# Altium schematic sheet main.SchDoc
size A2; SheetNumber: 1; SheetTotal: 4
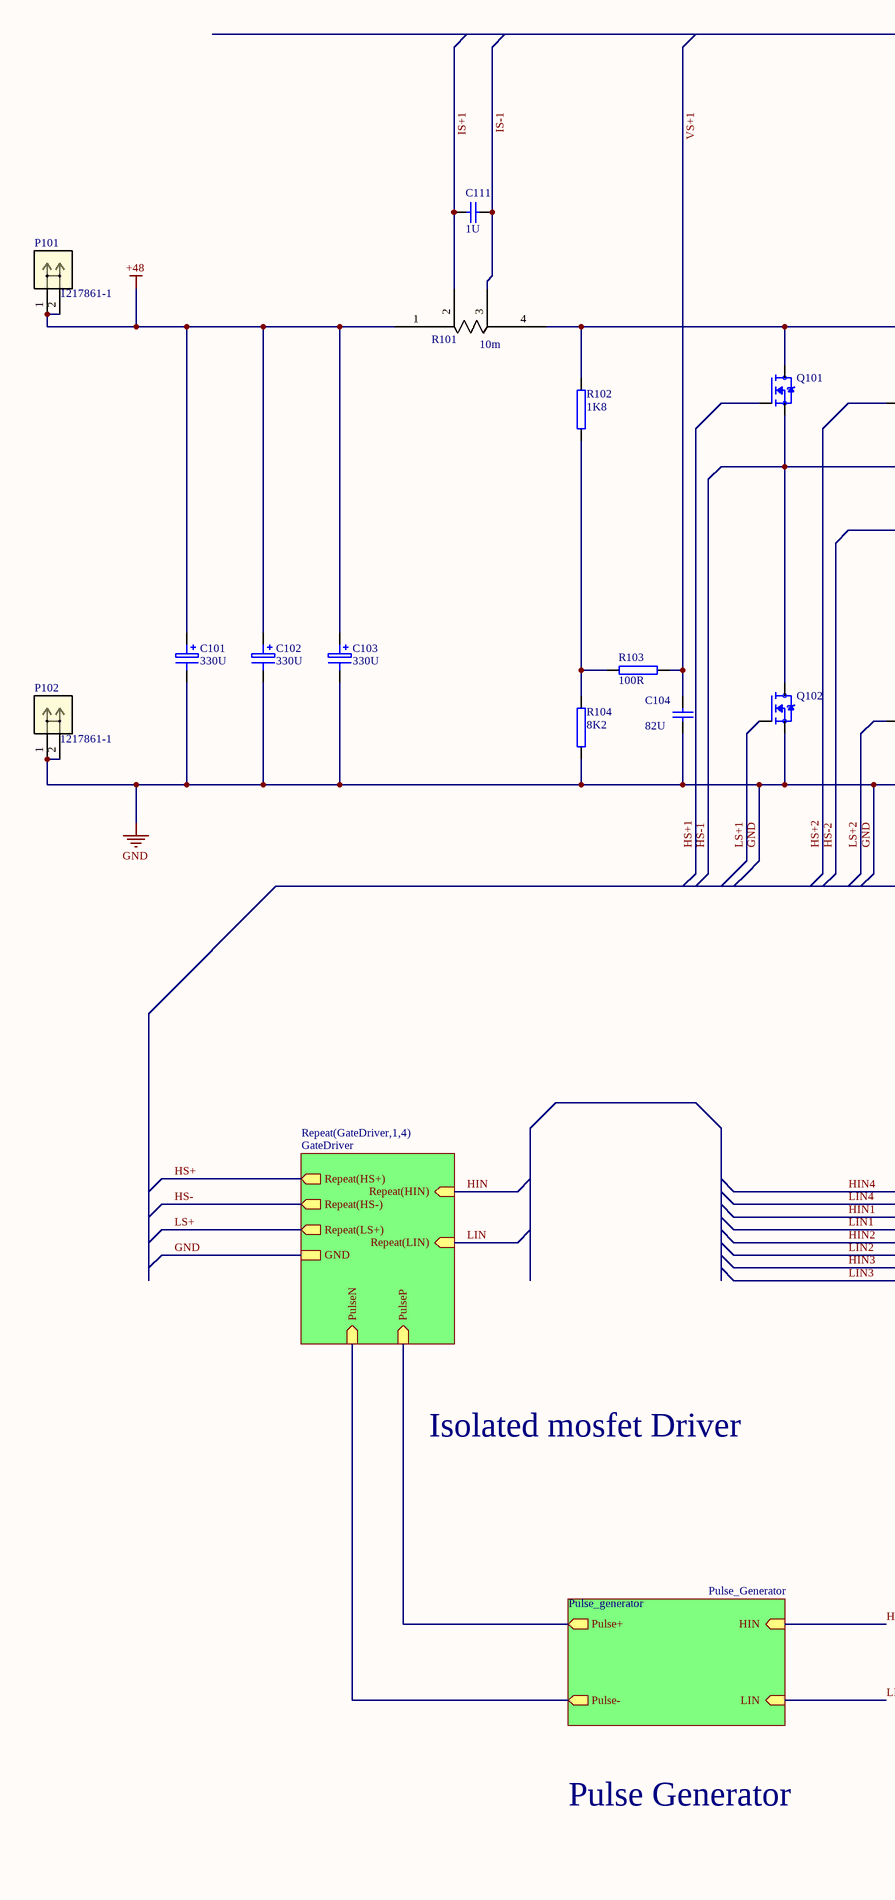
[diagram p0: main.SchDoc, left]
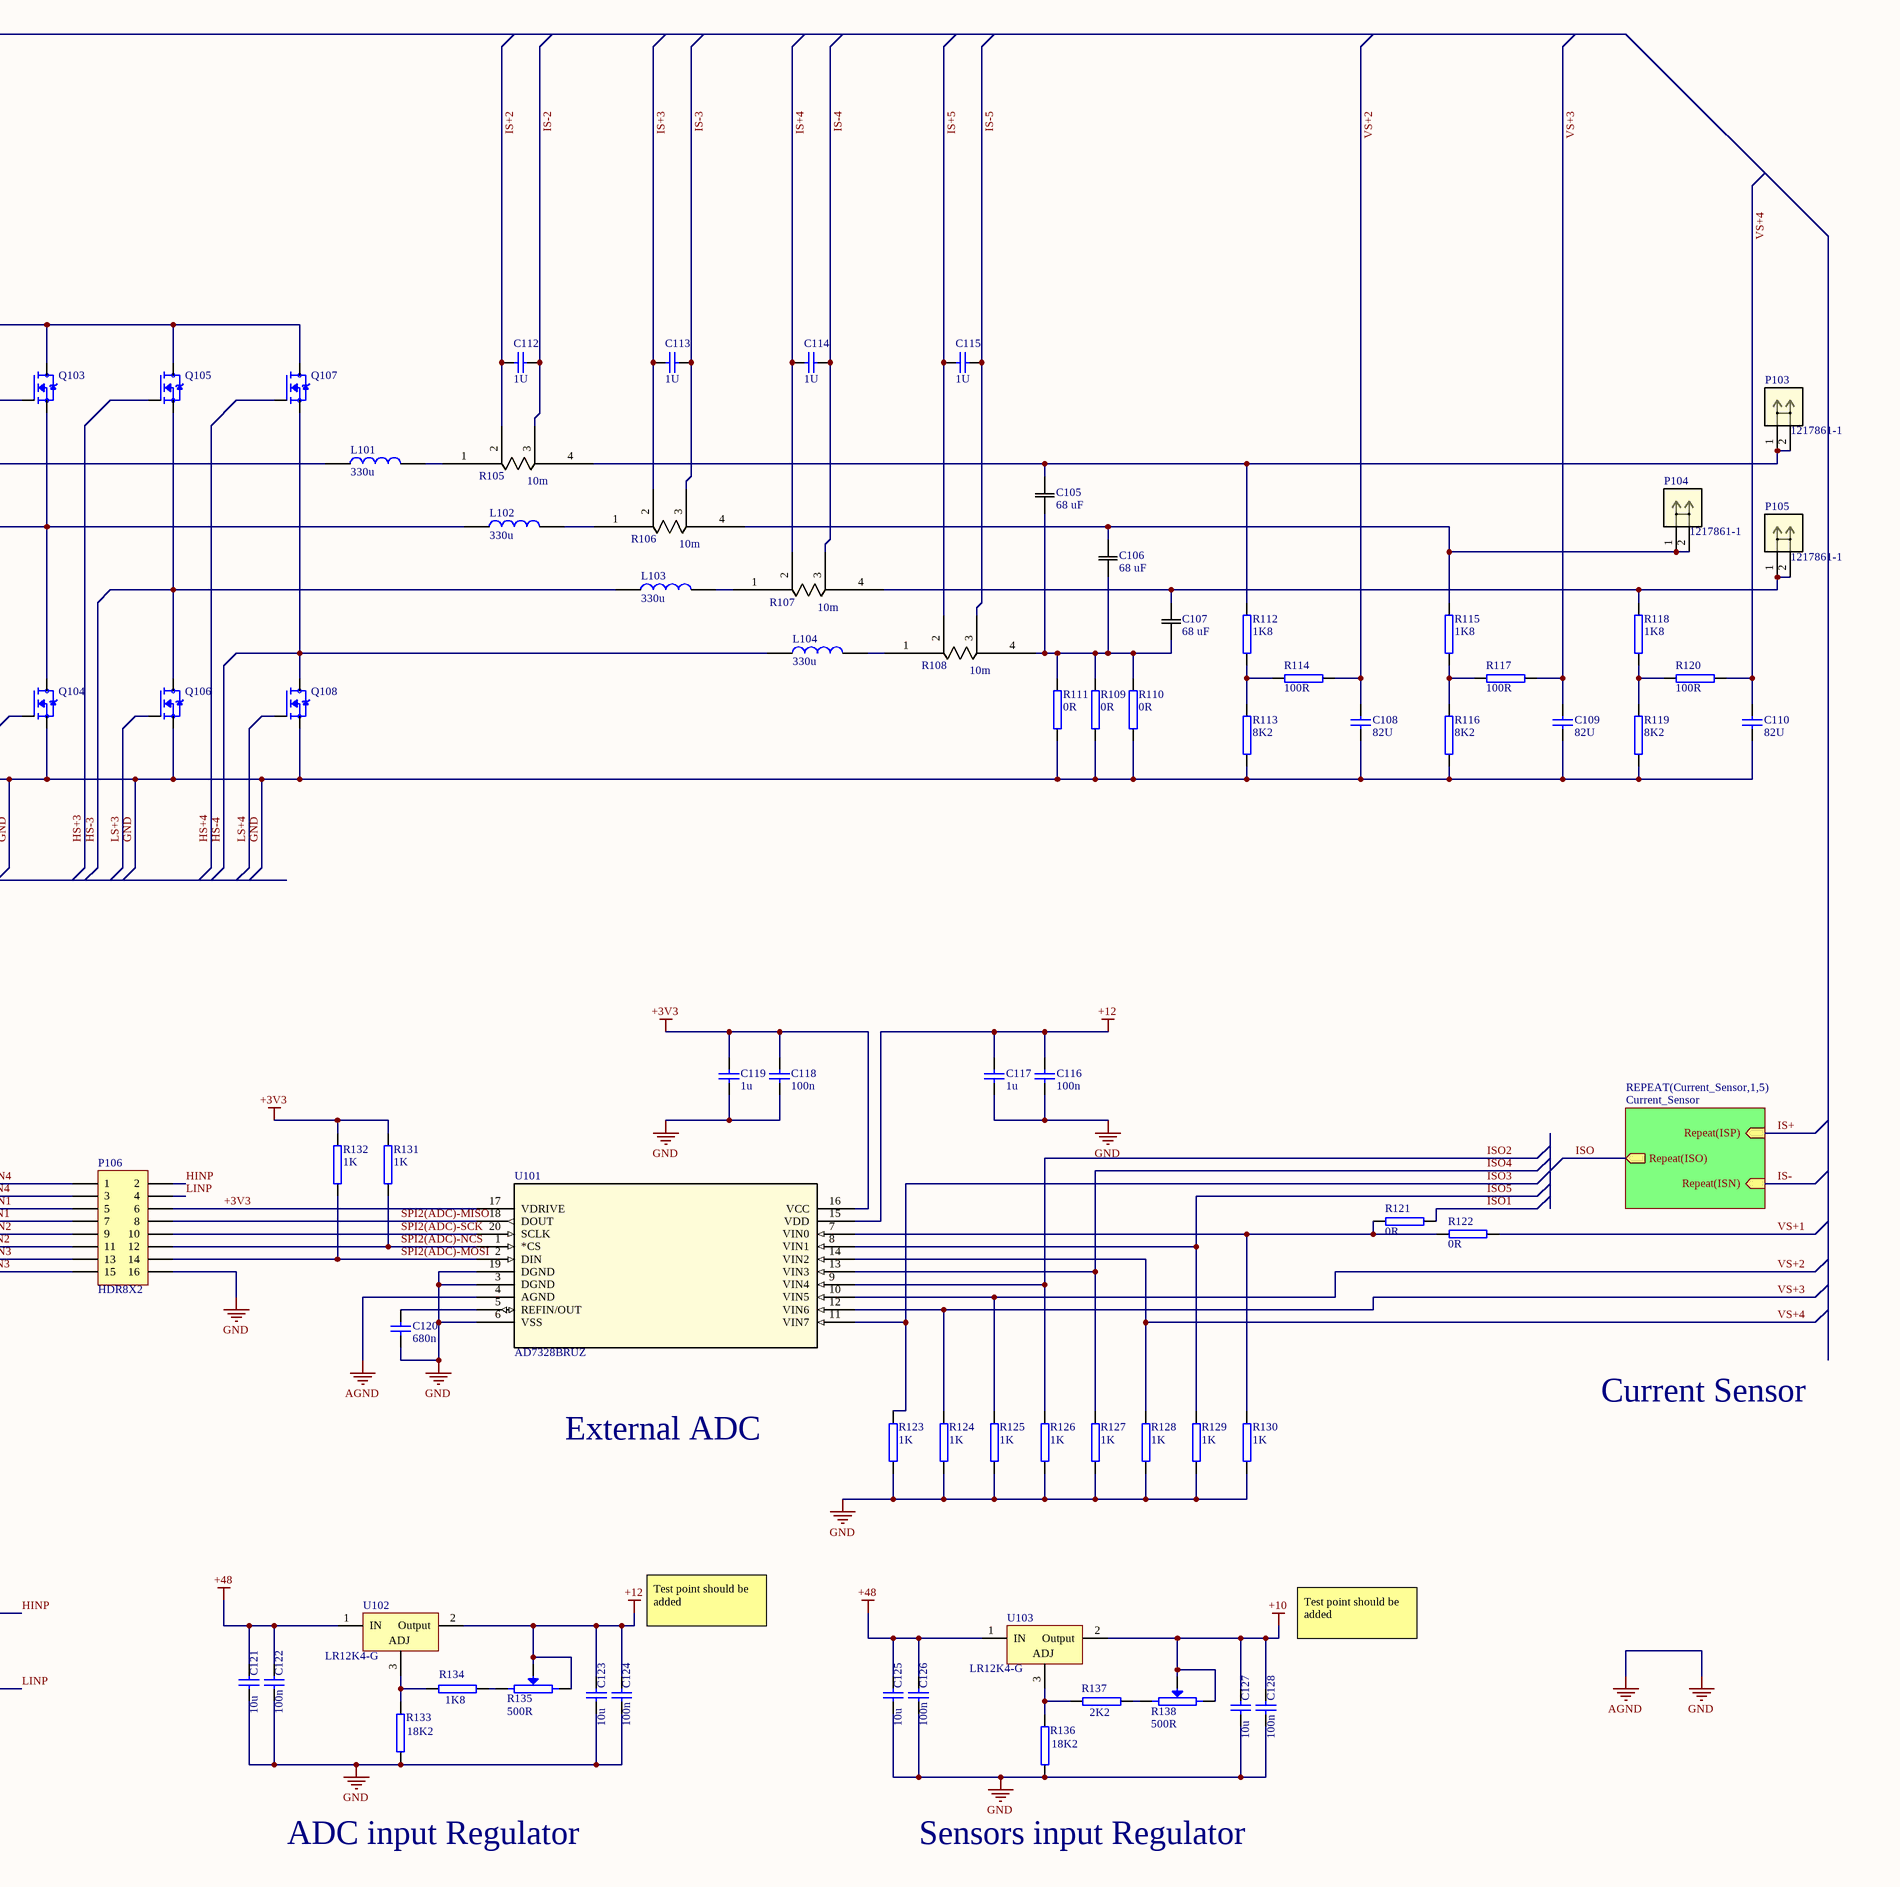
[diagram p1: main.SchDoc, right]

## Parts
C101  330U  [CAPP300-600_AUT]
C102  330U  [CAPP300-600_AUT]
C103  330U  [CAPP300-600_AUT]
C104  82U  [CAP_1206]
C105  68 uF  [B32526R3686K000]
C106  68 uF  [B32526R3686K000]
C107  68 uF  [B32526R3686K000]
C108  82U  [CAP_1206]
C109  82U  [CAP_1206]
C110  82U  [CAP_1206]
C111  1U  [CAP_1206]
C112  1U  [CAP_1206]
C113  1U  [CAP_1206]
C114  1U  [CAP_1206]
C115  1U  [CAP_1206]
C116  100n  [CAP_1206]
C117  1u  [CAP_1206]
C118  100n  [CAP_1206]
C119  1u  [CAP_1206]
C120  680n  [CAP_1206]
C121  10u  [CAP_1206]
C122  100n  [CAP_1206]
C123  10u  [CAP_1206]
C124  100n  [CAP_1206]
C125  10u  [CAP_1206]
C126  100n  [CAP_1206]
C127  10u  [CAP_1206]
C128  100n  [CAP_1206]
L101  330u  [1140-331K-RC]
L102  330u  [1140-331K-RC]
L103  330u  [1140-331K-RC]
L104  330u  [1140-331K-RC]
P101  1217861-1  [CONN_1217861-1_TEC]
P102  1217861-1  [CONN_1217861-1_TEC]
P103  1217861-1  [CONN_1217861-1_TEC]
P104  1217861-1  [CONN_1217861-1_TEC]
P105  1217861-1  [CONN_1217861-1_TEC]
P106  HDR8X2  [HDR2X8_AUT]
Q101  MCTL80N20Y-TP  [TOLL-8L]  (value not drawn)
Q102  MCTL80N20Y-TP  [TOLL-8L]  (value not drawn)
Q103  MCTL80N20Y-TP  [TOLL-8L]  (value not drawn)
Q104  MCTL80N20Y-TP  [TOLL-8L]  (value not drawn)
Q105  MCTL80N20Y-TP  [TOLL-8L]  (value not drawn)
Q106  MCTL80N20Y-TP  [TOLL-8L]  (value not drawn)
Q107  MCTL80N20Y-TP  [TOLL-8L]  (value not drawn)
Q108  MCTL80N20Y-TP  [TOLL-8L]  (value not drawn)
R101  10m  [WSL3673R_002-01]
R102  1K8  [RES_1206]
R103  100R  [RES_1206]
R104  8K2  [RES_1206]
R105  10m  [WSL3673R_002-01]
R106  10m  [WSL3673R_002-01]
R107  10m  [WSL3673R_002-01]
R108  10m  [WSL3673R_002-01]
R109  0R  [RES_1206]
R110  0R  [RES_1206]
R111  0R  [RES_1206]
R112  1K8  [RES_1206]
R113  8K2  [RES_1206]
R114  100R  [RES_1206]
R115  1K8  [RES_1206]
R116  8K2  [RES_1206]
R117  100R  [RES_1206]
R118  1K8  [RES_1206]
R119  8K2  [RES_1206]
R120  100R  [RES_1206]
R121  0R  [RES_1206]
R122  0R  [RES_1206]
R123  1K  [RES_1206]
R124  1K  [RES_1206]
R125  1K  [RES_1206]
R126  1K  [RES_1206]
R127  1K  [RES_1206]
R128  1K  [RES_1206]
R129  1K  [RES_1206]
R130  1K  [RES_1206]
R131  1K  [RES_1206]
R132  1K  [RES_1206]
R133  18K2  [RES_1206]
R134  1K8  [RES_1206]
R135  500R  [3296W]
R136  18K2  [RES_1206]
R137  2K2  [RES_1206]
R138  500R  [3296W]
U101  AD7328BRUZ  [TSSOP20_44]
U102  LR12K4-G  [D PAK (TO-252-3)]
U103  LR12K4-G  [D PAK (TO-252-3)]

## Sub-sheets
Pulse_generator = Pulse_Generator: HIN (in), LIN (in), Pulse+ (out), Pulse- (out)
REPEAT(Current_Sensor,1,5) = Current_Sensor: Repeat(ISP) (in), Repeat(ISN) (in), Repeat(ISO) (out)
Repeat(GateDriver,1,4) = GateDriver: Repeat(HIN) (in), Repeat(LIN) (in), Repeat(HS+) (out), Repeat(HS-) (out), Repeat(LS+) (out), GND, PulseN (in), PulseP (in)

## Nets
+3V3: C118.2 C119.2 P106.6 R131.2 R132.2 U101.16(VCC) U101.17(VDRIVE)
+10: C127.2 C128.2 R138.2(BOT) R138.W(TAP) U103.2(Output)
+12: C116.2 C117.2 C123.2 C124.2 R135.2(BOT) R135.W(TAP) U101.15(VDD) U102.2(Output)
+48: C101.1 C102.1 C103.1 C121.2 C122.2 C125.2 C126.2 P101.1 P101.2 R101.1 U102.1(IN) U103.1(IN)
GND: C101.2 C102.2 C103.2 C104.1 C108.1 C109.1 C110.1 C116.1 C117.1 C118.1 C119.1 C120.1 C121.1 C122.1 C123.1 C124.1 C125.1 C126.1 C127.1 C128.1 P102.1 P102.2 P106.16 Q102.2(S) Q104.2(S) Q106.2(S) Q108.2(S) R104.1 R109.2 R110.1 R111.2 R113.1 R116.1 R119.1 R123.1 R124.1 R125.1 R126.1 R127.1 R128.1 R129.1 R130.1 R133.1 R136.1 U101.3(DGND) U101.4(AGND) U101.6(VSS) U101.19(DGND) ; sheet Repeat(GateDriver,1,4)/GND  [also labelled AGND]
HIN: sheet Repeat(GateDriver,1,4)/Repeat(HIN)
HIN1: P106.5
HIN2: P106.9
HIN3: P106.13
HIN4: P106.1
HINP: P106.2 ; sheet Pulse_generator/HIN
HS+: sheet Repeat(GateDriver,1,4)/Repeat(HS+)
HS+1: Q101.1(G)
HS+2: Q103.1(G)
HS+3: Q105.1(G)
HS+4: Q107.1(G)
HS-: sheet Repeat(GateDriver,1,4)/Repeat(HS-)
HS-1: L101.1 Q101.2(S) Q102.3(D)
HS-2: L102.1 Q103.2(S) Q104.3(D)
HS-3: L103.1 Q105.2(S) Q106.3(D)
HS-4: L104.1 Q107.2(S) Q108.3(D)
IS+: sheet REPEAT(Current_Sensor,1,5)/Repeat(ISP)
IS+1: C111.2 R101.2
IS+2: C112.2 R105.2
IS+3: C113.2 R106.2
IS+4: C114.2 R107.2
IS+5: C115.2 R108.2
IS-: sheet REPEAT(Current_Sensor,1,5)/Repeat(ISN)
IS-1: C111.1 R101.3
IS-2: C112.1 R105.3
IS-3: C113.1 R106.3
IS-4: C114.1 R107.3
IS-5: C115.1 R108.3
ISO: sheet REPEAT(Current_Sensor,1,5)/Repeat(ISO)
ISO1: R121.2
ISO2: R126.2 U101.9(VIN4)
ISO3: R123.2 U101.11(VIN7)
ISO4: R127.2 U101.13(VIN3)
ISO5: R129.2 U101.8(VIN1)
LIN: sheet Repeat(GateDriver,1,4)/Repeat(LIN)
LIN1: P106.7
LIN2: P106.11
LIN3: P106.15
LIN4: P106.3
LINP: P106.4 ; sheet Pulse_generator/LIN
LS+: sheet Repeat(GateDriver,1,4)/Repeat(LS+)
LS+1: Q102.1(G)
LS+2: Q104.1(G)
LS+3: Q106.1(G)
LS+4: Q108.1(G)
SPI2(ADC)-MISO: P106.8 U101.18(DOUT)
SPI2(ADC)-MOSI: P106.14 R132.1 U101.2(DIN)
SPI2(ADC)-NCS: P106.12 R131.1 U101.1(*CS)
SPI2(ADC)-SCK: P106.10 U101.20(SCLK)
VS+1: C104.2 R103.1 R122.2
VS+2: C108.2 R114.1 R125.2 U101.10(VIN5)
VS+3: C109.2 R117.1 R124.2 U101.12(VIN6)
VS+4: C110.2 R120.1 R128.2 U101.14(VIN2)
NetC105_1: C105.1 C106.1 C107.1 R108.4 R109.1 R110.2 R111.1
NetC105_2: C105.2 P103.1 P103.2 R105.4 R112.2
NetC106_2: C106.2 P104.1 P104.2 R106.4 R115.2
NetC107_2: C107.2 P105.1 P105.2 R107.4 R118.2
NetC120_2: C120.2 U101.5(REFIN/OUT)
NetL101_2: L101.2 R105.1
NetL102_2: L102.2 R106.1
NetL103_2: L103.2 R107.1
NetL104_2: L104.2 R108.1
NetQ101_3: Q101.3(D) Q103.3(D) Q105.3(D) Q107.3(D) R101.4 R102.2
NetR102_1: R102.1 R103.2 R104.2
NetR112_1: R112.1 R113.2 R114.2
NetR115_1: R115.1 R116.2 R117.2
NetR118_1: R118.1 R119.2 R120.2
NetR121_1: R121.1 R122.1 R130.2 U101.7(VIN0)
NetR133_2: R133.2 R134.2 U102.3(ADJ)
NetR134_1: R134.1 R135.1(TOP)
NetR136_2: R136.2 R137.2 U103.3(ADJ)
NetR137_1: R137.1 R138.1(TOP)
(unnamed): sheet Repeat(GateDriver,1,4)/PulseN, sheet Pulse_generator/Pulse-
(unnamed): sheet Repeat(GateDriver,1,4)/PulseP, sheet Pulse_generator/Pulse+

## Notes on the sheet
- Isolated mosfet Driver
- External ADC
- Current Sensor
- Test point should be added
- Pulse Generator
- ADC input Regulator
- Sensors input Regulator

## Library data of the parts
C101-C103 = CAPP300-600: Polarized Aluminum Capacitor, Through Hole, Pitch 300mil, Body 600mil (Dia)
C104 C108-C128 = CAPN 1206: Non Polarized Capacitor, SMD, 1206
C105-C107 = B32526R3686K000: 68 µF Film Capacitor 160V 250V Polyester, Polyethylene Terephthalate (PET), Metallized Radial / https://www.digikey.co.nz/en/products/detail/epcos-tdk-electronics/B32526R3686K000/3490213; ComponentLink1Description: New link; ComponentLink1URL: https://www.digikey.co.nz/en/products/detail/epcos-tdk-electronics/B32526R3686K000/3490213
L101-L104 = 1140-331K-RC: Power Inductors - Leaded 330uH 10% / https://nz.mouser.com/ProductDetail/Bourns/1140-331K-RC?qs=wiQ7G1Lt8gwP8A01VI%2FcoA%3D%3D; ComponentLink1Description: New link; ComponentLink1URL: https://nz.mouser.com/ProductDetail/Bourns/1140-331K-RC?qs=wiQ7G1Lt8gwP8A01VI%2FcoA%3D%3D
P101-P105 = 1217861-1: 250 FASTON,PCB TAB,TCBR / https://www.digikey.co.nz/en/products/detail/te-connectivity-amp-connectors/1217861-1/1148769?s=N4IgTCBcDaIIIEYAMSAsBWMAVASgWgDkAREAXQF8g; ComponentLink1Description: New link; ComponentLink1URL: https://www.digikey.co.nz/en/products/detail/te-connectivity-amp-connectors/1217861-1/1148769?s=N4IgTCBcDaIIIEYAMSAsBWMAVASgWgDkAREAXQF8g
P106 = HDR8X2: Header, 8-Pin, Dual row, 2.54mm Pitch, Straight; Supplier 1: Farnell; Supplier Part Number 1: 9733620
Q101-Q108 = MCTL80N20Y-TP: N-Channel 200 V 80A (Tc) 250W (Tj) Surface Mount TOLL-8L
R101 R105-R108 = WSL3673R-01: Current Shunt / Kelvin 4W 0.002- 0.01
R102-R104 R109-R134 R136 R137 = Resistor 1206: Resistor, SMD, 1206
R135 R138 = 3296W-1-104LF: 3296W Series, 3/8 ” Square Potentiometer, 100k, 10%,  0.5 Watts, Multi Turn / Part #: PV36W501C01B00; Supplier 1: Farnell; Supplier Part Number 1: 9353194
U101 = AD7328BRUZ: ADC 12 Bit / Package TSSOP20
U102 U103 = LR12K4-G: Adj Positive Regulator / Linear. 12V dropout V. / 2W